# EAGLE design sidewinder (EAGLE 9.6.2)
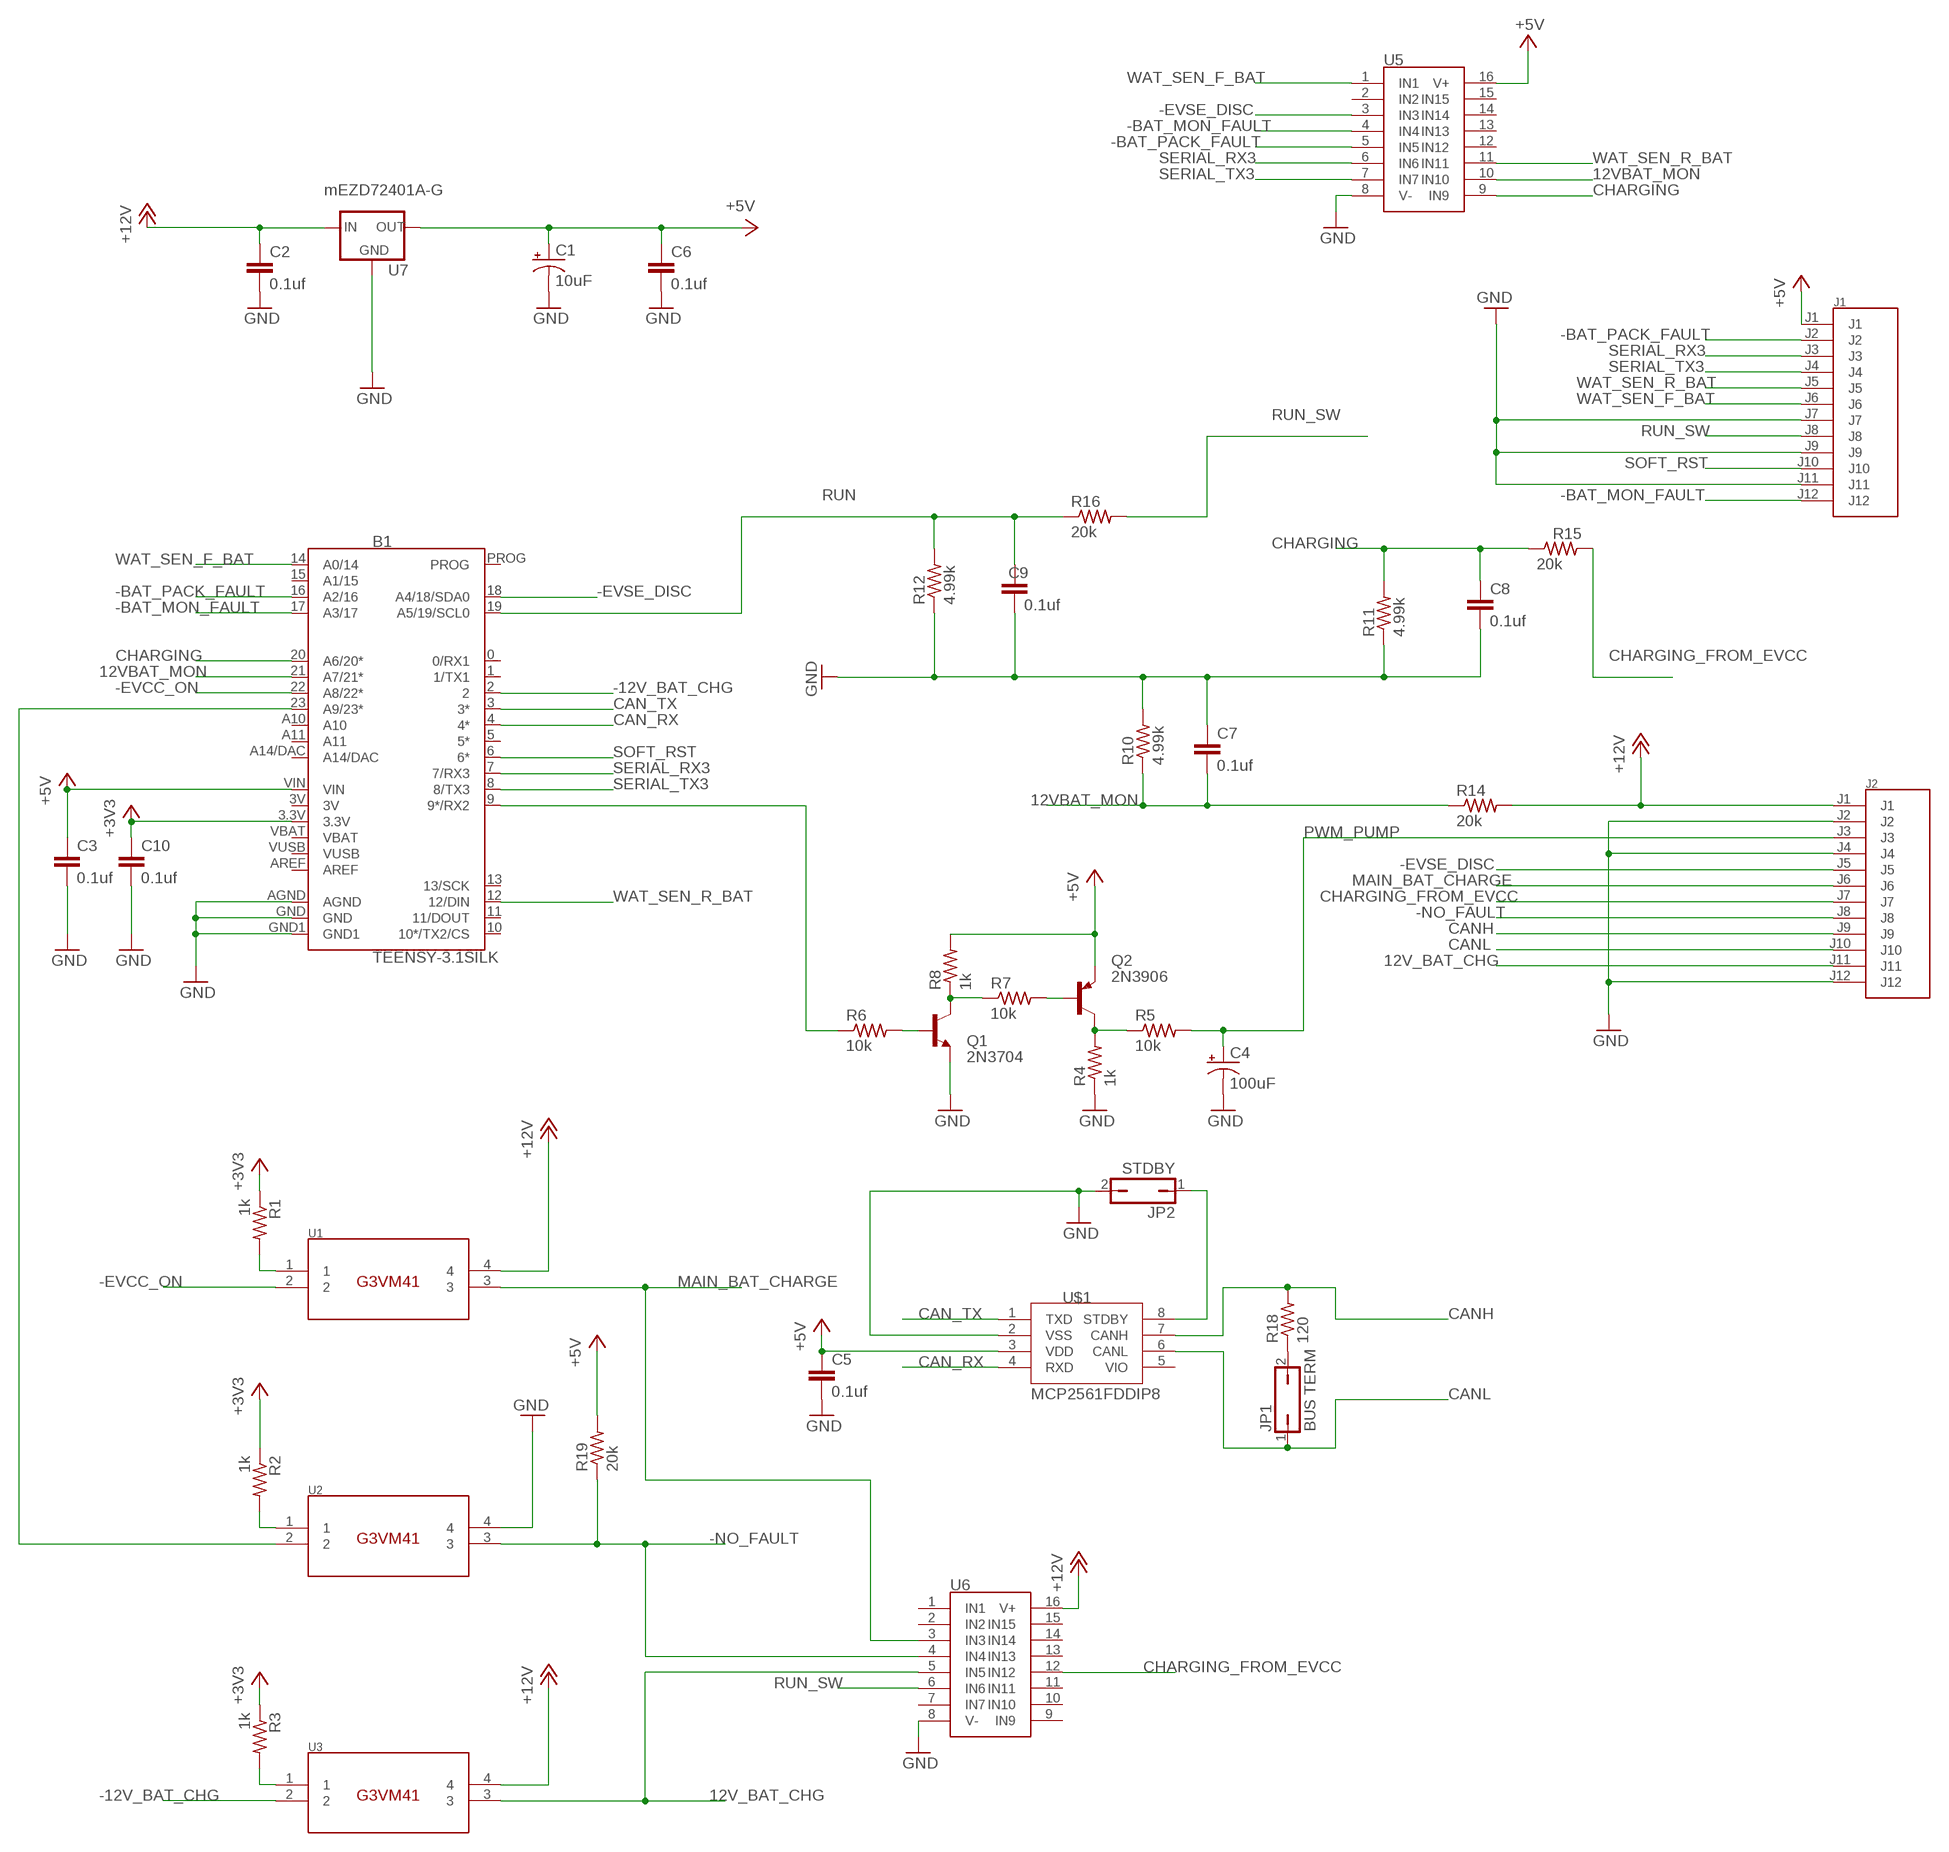
[diagram p0: schematic, sheet 1]

## Parts
B1  TEENSY-3.1SILK  [TEENSY-3.1]
C1  10uF  10UF-POLAR-RADIAL-2.5MM-25V-20%  [CPOL-RADIAL-2.5MM-5MM]
C2  0.1uf  C2.5/2  [C2.5-2]
C3  0.1uf  C2.5/2  [C2.5-2]
C4  100uF  100UF-POLAR-RADIAL-2.5MM-25V-20%  [CPOL-RADIAL-2.5MM-6.5MM]
C5  0.1uf  C2.5/2  [C2.5-2]
C6  0.1uf  C2.5/2  [C2.5-2]
C7  0.1uf  C2.5/2  [C2.5-2]
C8  0.1uf  C2.5/2  [C2.5-2]
C9  0.1uf  C2.5/2  [C2.5-2]
C10  0.1uf  C2.5/2  [C2.5-2]
J1  TERMINAL12  [TERMINAL12]
J2  TERMINAL12  [TERMINAL12]
JP1  BUS TERM  JP1Q  [JP1]
JP2  STDBY  JP1Q  [JP1]
Q1  2N3704  [TO92]
Q2  2N3906  [TO92]
R1  1k  R-US_0207/10  [0207/10]
R2  1k  R-US_0207/10  [0207/10]
R3  1k  R-US_0207/10  [0207/10]
R4  1k  R-US_0207/10  [0207/10]
R5  10k  R-US_0207/10  [0207/10]
R6  10k  R-US_0207/10  [0207/10]
R7  10k  R-US_0207/10  [0207/10]
R8  1k  R-US_0207/10  [0207/10]
R10  4.99k  R-US_0207/10  [0207/10]
R11  4.99k  R-US_0207/10  [0207/10]
R12  4.99k  R-US_0207/10  [0207/10]
R14  20k  R-US_0207/10  [0207/10]
R15  20k  R-US_0207/10  [0207/10]
R16  20k  R-US_0207/10  [0207/10]
R18  120  R-US_0207/10  [0207/10]
R19  20k  R-US_0207/10  [0207/10]
U1  G3VM41  [G3VM41]
U2  G3VM41  [G3VM41]
U3  G3VM41  [G3VM41]
U5  SP720APP  [DIP16]
U6  SP720APP  [DIP16]
U7  mEZD72401A-G  V_REG_78XXSINK  [TO220-IGO]
U$1  MCP2561FDDIP8  [DIP787W45P254L949H533Q8B]

## Nets
12V_BAT_CHG: J2.J11 U3.3 U6.5(IN5)
12VBAT_MON: B1.21(A7/21*) C7.2 R10.1 R14.1 U5.10(IN10)
+3V3 [VCC]: B1.3.3V C10.1 R1.1 R2.1 R3.1
+5V [VCC]: B1.VIN C1.1(+) C3.1 C5.1 C6.1 J1.J1 Q2.3(E) R8.2 R19.2 U5.16(V+) U7.OUT U$1.3(VDD)
+12V [VCC]: C2.1 J2.J1 R14.2 U1.4 U3.4 U6.16(V+) U7.IN
-12V_BAT_CHG: B1.2 U3.2
-BAT_MON_FAULT: B1.17(A3/17) J1.J12 U5.4(IN4)
-BAT_PACK_FAULT: B1.16(A2/16) J1.J2 U5.5(IN5)
-EVCC_ON: B1.22(A8/22*) U1.2
-EVSE_DISC: B1.18(A4/18/SDA0) J2.J5 U5.3(IN3)
-NO_FAULT: J2.J8 R19.1 U2.3 U6.4(IN4)
CAN_RX: B1.4(4*) U$1.4(RXD)
CAN_TX: B1.3(3*) U$1.1(TXD)
CANH: J2.J9 R18.2 U$1.7(CANH)
CANL: J2.J10 JP1.1 U$1.6(CANL)
CHARGING: B1.20(A6/20*) C8.1 R11.2 R15.1 U5.9(IN9)
CHARGING_FROM_EVCC: J2.J7 R15.2 U6.12(IN12)
GND: B1.AGND B1.GND B1.GND1 C1.2(-) C2.2 C3.2 C4.2(-) C5.2 C6.2 C7.1 C8.2 C9.2 C10.2 J1.J7 J1.J9 J1.J11 J2.J2 J2.J4 J2.J12 JP2.2 Q1.3(E) R4.1 R10.2 R11.1 R12.1 U2.4 U5.8(V-) U6.8(V-) U7.GND U$1.2(VSS)
MAIN_BAT_CHARGE: J2.J6 U1.3 U6.3(IN3)
N$1: B1.23(A9/23*) U2.2
N$3: B1.9(9*/RX2) R6.1
N$5: Q1.1(B) R6.2
N$6: Q1.2(C) R7.1 R8.1
N$7: Q2.2(B) R7.2
N$8: R1.2 U1.1
N$9: R2.2 U2.1
N$10: R3.2 U3.1
N$11: Q2.1(C) R4.2 R5.1
N$12: JP2.1 U$1.8(STDBY)
N$13: JP1.2 R18.1
PWM_PUMP: C4.1(+) J2.J3 R5.2
RUN: B1.19(A5/19/SCL0) C9.1 R12.2 R16.1
RUN_SW: J1.J8 R16.2 U6.6(IN6)
SERIAL_RX3: B1.7(7/RX3) J1.J3 U5.6(IN6)
SERIAL_TX3: B1.8(8/TX3) J1.J4 U5.7(IN7)
SOFT_RST: B1.6(6*) J1.J10
WAT_SEN_F_BAT: B1.14(A0/14) J1.J6 U5.1(IN1)
WAT_SEN_R_BAT: B1.12(12/DIN) J1.J5 U5.11(IN11)
Unconnected: B1.0(0/RX1) B1.1(1/TX1) B1.5(5*) B1.10(10*/TX2/CS) B1.11(11/DOUT) B1.13(13/SCK) B1.15(A1/15) B1.A10 B1.A11 B1.A14/DAC B1.AREF B1.PROG U5.2(IN2) U5.12(IN12) U5.13(IN13) U5.14(IN14) U5.15(IN15) U6.1(IN1) U6.2(IN2) U6.7(IN7) U6.9(IN9) U6.10(IN10) U6.11(IN11) U6.13(IN13) U6.14(IN14) U6.15(IN15) U$1.5(VIO)

## Power pins joined to a net without a drawn wire
3V: B1.3V
VBAT: B1.VBAT
VUSB: B1.VUSB

## Library data of the parts
B1 = SparkFun-Boards:TEENSY-3.1: Teensy 3+ Footprint Mechanical footprint with connectors for Teensy Development Board with ARM Cortex. SparkFun Products: Teensy 3.2 <https://www.sparkfun.com/products/13736> Teensy LC <https://www.sparkfun.com/products/13305>; SF_ID: DEV-12646
C1 = SparkFun-Capacitors:10UF-POLAR: 10.0µF polarized capacitors A capacitor is a passive two-terminal electrical component used to store electrical energy temporarily in an electric field.; PROD_ID: CAP-08440
C2 C3 C5-C10 = capacitor-wima:C: CAPACITOR naming: grid - package width
C4 = SparkFun-Capacitors:100UF-POLAR: 100µF polarized capacitors A capacitor is a passive two-terminal electrical component used to store electrical energy temporarily in an electric field.; PROD_ID: CAP-08439
J1 J2 = terminal12:TERMINAL12
JP1 JP2 = jumper:JP1Q: JUMPER
Q1 = transistor:2N3704: NPN TRANSISTOR
Q2 = transistor-pnp:2N3906: PNP Transistor
R1-R8 R10-R12 R14-R16 R18 R19 = rcl:R-US_: RESISTOR, American symbol; SPICEPREFIX: R
U1-U3 = G3VM41:G3VM41
U5 U6 = sp720app:SP720APP
U7 = SparkFun-IC-Power:V_REG_78XX: Voltage Regulator Standard 78xx regulator. IGO (Input Ground Output). Spark Fun Electronics SKU : COM-00107
U$1 = MCP2561FD:MCP2561FD

## Module BMS
Ports: +5V(io)

### Library data of the parts

## Net classes
0 default: width 0.305 mm, drill 0.508 mm, clearance 0.305 mm
1 VCC: width 0.508 mm, drill 0.508 mm, clearance 0.508 mm

## Board
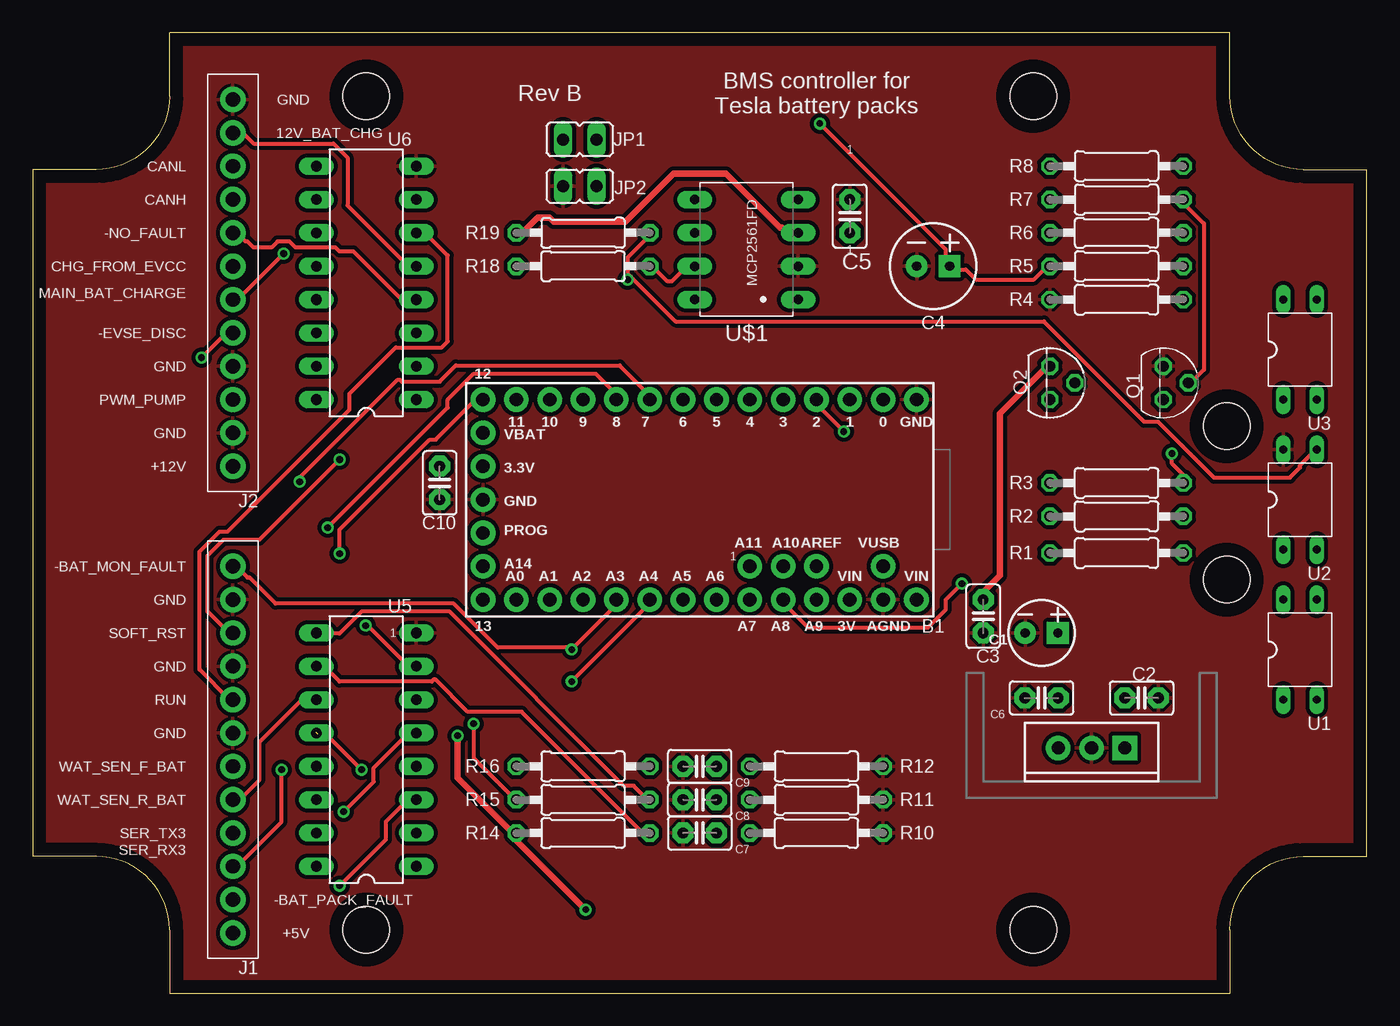
[diagram p1: board, top side]
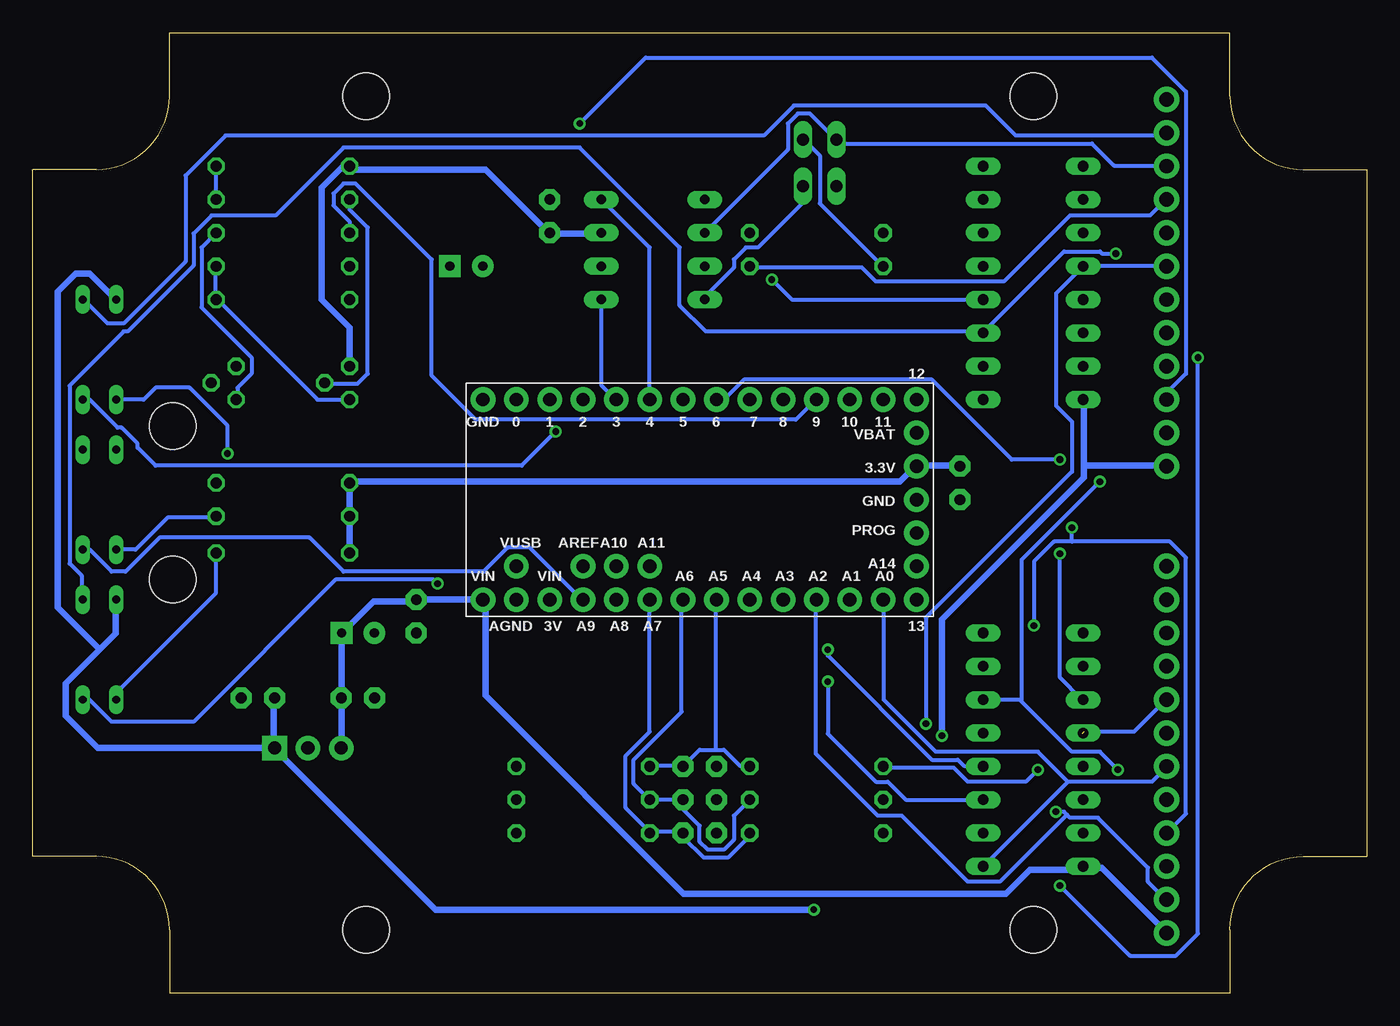
[diagram p2: board, bottom side, seen from below]

Size 101.6 x 73.15 mm. Coordinates in mm from the lower left corner, seen from the top.
Outline: 91.19,73.15 10.41,73.15 10.41,68.33 arc-90 4.83,62.74 0,62.74 0,10.41 4.83,10.41 arc-90 10.41,4.83 10.41,0 91.19,0 91.19,4.83 arc-90 96.77,10.41 101.6,10.41 101.6,62.74 96.77,62.74 arc-90 91.19,68.33 91.19,73.15
Copper layers (1*16): Top 0.035mm / dielectric 1.5mm / Bottom 0.035mm
Design rules "default": minimum track width 6mil, minimum drill 0.35mm, track to track 6mil, track to pad 6mil, pad to pad 6mil, via to via 6mil, smd to smd 6mil, copper to edge 40mil, drill to drill 6mil, minimum pad ring 10mil, minimum via ring 8mil, stop-mask expansion 4mil, vias tented up to drill 0mil, thermal gap 10mil
Holes 3.56 mm at 76.2,68.33 25.4,68.33 76.2,4.83 25.4,4.83 90.93,31.5 90.93,43.18

### Footprints (pad centres in the part's own frame; a part is rotated, then mirrored left to right if it is on the bottom)
TEENSY-3.1 = drill 1.016 pad 1.88: 0 7.62,-13.97; 1 7.62,-11.43; 2 7.62,-8.89; 3 7.62,-6.35; 3.3V 2.54,16.51; 3V -7.62,-11.43; 4 7.62,-3.81; 5 7.62,-1.27; 6 7.62,1.27; 7 7.62,3.81; 8 7.62,6.35; 9 7.62,8.89; 10 7.62,11.43; 11 7.62,13.97; 12 7.62,16.51; 13 -7.62,16.51; 14 -7.62,13.97; 15 -7.62,11.43; 16 -7.62,8.89; 17 -7.62,6.35; 18 -7.62,3.81; 19 -7.62,1.27; 20 -7.62,-1.27; 21 -7.62,-3.81; 22 -7.62,-6.35; 23 -7.62,-8.89; A10 -5.08,-6.35; A11 -5.08,-3.81; A14/DAC -5.08,16.51; AGND -7.62,-13.97; AREF -5.08,-8.89; GND 0,16.51; GND1 7.62,-16.51; PROG -2.54,16.51; VBAT 5.08,16.51; VIN -7.62,-16.51; VUSB -5.08,-13.97
CPOL-RADIAL-2.5MM-5MM = drill 0.7 pad 1.651 square: 1 1.25,0 | drill 0.7 pad 1.651: 2 -1.25,0
C2.5-2 = drill 0.813 pad 1.6 octagon: 1 -1.27,0; 2 1.27,0
CPOL-RADIAL-2.5MM-6.5MM = drill 0.7 pad 1.651 square: 1 1.25,0 | drill 0.7 pad 1.651: 2 -1.25,0
TERMINAL12 = drill 1.092 pad 1.93: J1 -2.54,16.51; J2 -2.54,13.97; J3 -2.54,11.43; J4 -2.54,8.89; J5 -2.54,6.35; J6 -2.54,3.81; J7 -2.54,1.27; J8 -2.54,-1.27; J9 -2.54,-3.81; J10 -2.54,-6.35; J11 -2.54,-8.89; J12 -2.54,-11.43
JP1 = drill 0.914 long: 1 0,-1.27; 2 0,1.27
TO92 = drill 0.813 octagon: 1 1.27,0; 2 0,1.905; 3 -1.27,0
0207/10 = drill 0.813 octagon: 1 -5.08,0; 2 5.08,0
G3VM41 = drill 0.6 long: 1 -3.81,1.27; 2 -3.81,-1.27; 3 3.81,-1.27; 4 3.81,1.27
DIP16 = drill 0.813 long: 1 -7.62,-3.81; 2 -5.08,-3.81; 3 -2.54,-3.81; 4 0,-3.81; 5 2.54,-3.81; 6 5.08,-3.81; 7 7.62,-3.81; 8 10.16,-3.81; 9 10.16,3.81; 10 7.62,3.81; 11 5.08,3.81; 12 2.54,3.81; 13 0,3.81; 14 -2.54,3.81; 15 -5.08,3.81; 16 -7.62,3.81
TO220-IGO = drill 1 pad 1.88: GND 0,0; OUT 2.54,0 | drill 1 pad 1.88 square: IN -2.54,0
DIP787W45P254L949H533Q8B = drill 0.723 pad 1.323 long: 1 -3.937,3.81; 2 -3.937,1.27; 3 -3.937,-1.27; 4 -3.937,-3.81; 5 3.937,-3.81; 6 3.937,-1.27; 7 3.937,1.27; 8 3.937,3.81

### Placement (x,y rotation side)
B1  50.8,37.59 90 top
C1  76.84,27.43 0 top
C2  84.45,22.48 0 top
C3  72.39,28.7 270 top
C4  68.58,55.37 0 top
C5  62.23,59.18 90 top
C6  76.84,22.48 180 top
C7  50.8,12.19 0 top
C8  50.8,14.73 180 top
C9  50.8,17.27 180 top
C10  30.99,38.86 270 top
J1  12.7,21.08 180 top
J2  12.7,56.64 180 top
JP1  41.66,65.02 270 top
JP2  41.66,61.47 90 top
Q1  86.11,46.48 270 top
Q2  77.47,46.48 270 top
R1  82.55,33.53 0 top
R2  82.55,36.32 0 top
R3  82.55,38.86 0 top
R4  82.55,52.83 0 top
R5  82.55,55.37 180 top
R6  82.55,57.91 0 top
R7  82.55,60.45 180 top
R8  82.55,62.99 180 top
R10  59.69,12.19 0 top
R11  59.69,14.73 180 top
R12  59.69,17.27 180 top
R14  41.91,12.19 180 top
R15  41.91,14.73 180 top
R16  41.91,17.27 180 top
R18  41.91,55.37 0 top
R19  41.91,57.91 180 top
U1  96.52,26.16 90 top
U2  96.52,37.59 90 top
U3  96.52,49.02 90 top
U5  25.4,17.27 90 top
U6  25.4,52.83 90 top
U7  80.64,18.67 180 top
U$1  54.36,56.64 180 top

### Tracks (layer width: path | path; a pad name or v marks a point on that pad's centre or on a via)
12V_BAT_CHG
  Top 0.305: U6.5 29.16,55.42 28.55,55.42 23.98,59.99 23.98,63.65 22.91,64.72 16.81,64.72 16.05,65.48 15.29,65.48 J2.J11
  Bottom 0.305: J2.J11 15.44,65.33 26.72,65.33 29.01,67.62 43.64,67.62 45.92,65.33 86.92,65.33 89.97,62.28 89.97,55.73 94.69,51 95.91,51 97.74,52.83 U3.3
12VBAT_MON
  Top 0.305: U5.10 21.69,24.79 22.3,24.79 23.37,23.72 30.38,23.72 30.53,23.88 30.68,23.88 33.12,21.44 37.24,21.44 46.38,12.29 46.99,12.29 R14.1
  Bottom 0.305: 54.61,12.29 52.17,12.29 C7.2 52.02,12.14 52.02,11.84 50.5,10.31 48.67,10.31 46.99,11.99 R14.1 | B1.21 54.61,19.91 56.44,18.09 56.44,14.12 54.61,12.29 | 54.61,12.29 R10.1
+3V3
  Bottom 0.508: R1.1 R2.1 R3.1 77.32,38.96 35.56,38.96 34.49,40.03 B1.3.3V 34.19,40.18 30.99,40.18 C10.1
+5V
  Top 0.508: R19.2 36.93,58.01 37.39,58.01 38.46,59.08 39.37,59.08 39.67,58.78 45.16,58.78 48.82,62.43 52.78,62.43 56.9,58.32 57.05,58.32 57.35,58.01 58.27,58.01 U$1.3 | Q2.3 77.47,47.65 77.17,47.65 73.66,44.14 73.66,31.8 72.44,30.58 72.44,29.97 C3.1
  Bottom 0.508: Q2.3 77.47,50.7 79.6,52.83 79.6,61.37 78.08,62.89 77.47,62.89 R8.2 77.32,62.74 67.11,62.74 62.38,58.01 C5.1 62.23,57.86 58.42,57.86 U$1.3 | J1.J1 15.29,4.67 20.17,9.55 21.54,9.55 U5.16 21.69,9.4 25.65,9.4 27.48,7.57 52.02,7.57 67.11,22.66 67.11,29.82 B1.VIN C3.1 72.59,29.82 75.64,29.82 77.93,27.53 C1.1 78.08,27.38 78.08,22.66 C6.1 78.08,22.35 78.08,18.69 U7.OUT
+12V  (via drill 0.51)
  Top 0.508: v32.36,19.61 32.36,16.41 36.47,12.29 36.78,12.29 R14.2 36.78,11.99 36.78,11.68 v42.11,6.35
  Bottom 0.508: 96.52,26.16 99.11,23.57 99.11,21.13 96.67,18.69 83.26,18.69 U7.IN | 96.52,26.16 95.3,27.38 95.3,29.97 U1.4 | 96.52,26.16 99.72,29.36 99.72,53.44 98.35,54.81 97.28,54.81 95.3,52.83 U3.4 | C2.1 83.26,22.35 83.26,18.85 U7.IN | v32.36,19.61 32.36,28.45 21.54,39.27 21.54,40.18 | 21.54,40.18 21.54,45.21 U6.16 | 21.54,40.18 15.29,40.18 J2.J1 | v42.11,6.35 70.92,6.35 83.11,18.54 U7.IN
-12V_BAT_CHG  (via drill 0.51)
  Top 0.305: v61.77,42.77 59.79,44.75 59.79,45.21 B1.2
  Bottom 0.305: U3.2 97.28,45.21 95.15,43.08 94.84,43.08 93.62,41.86 93.62,41.55 92.25,40.18 64.36,40.18 v61.77,42.77
-BAT_MON_FAULT  (via drill 0.51)
  Top 0.305: B1.17 44.4,29.97 44.4,29.52 v41.05,26.16 41.05,26.31 35.41,26.31 32.05,29.67 18.49,29.67 16.51,31.65 16.36,31.65 15.6,32.41 15.29,32.41 J1.J12
  Bottom 0.305: v41.05,26.16 41.05,25.7 33.12,17.78 31.14,17.78 30.68,17.32 29.31,17.32 U5.4
-BAT_PACK_FAULT  (via drill 0.51)
  Top 0.305: v23.67,13.82 25.96,16.1 25.96,17.17 28.55,19.76 29.16,19.76 U5.5
  Bottom 0.305: v23.67,13.82 23.06,13.82 22.84,13.59 | 22.84,13.59 22.61,13.36 20.47,13.36 16.66,9.55 16.66,8.48 15.29,7.11 J1.J2 | 22.84,13.59 27.94,8.48 30.38,8.48 35.41,13.51 37.24,13.51 41.96,18.24 41.96,29.97 B1.16
-EVCC_ON  (via drill 0.51)
  Top 0.305: v70.76,31.19 69.55,29.97 69.55,29.21 68.17,27.84 59.03,27.84 57.2,29.67 57.2,29.97 B1.22
  Bottom 0.305: U1.2 97.28,22.35 95.61,20.68 89.36,20.68 78.54,31.5 71.07,31.5 v70.76,31.19
-EVSE_DISC  (via drill 0.51)
  Top 0.305: v41.05,23.72 46.99,29.67 B1.18 | v12.85,48.41 14.68,50.24 15.14,50.24 J2.J5 | v23.37,8.18 26.87,11.68 26.87,13.06 28.55,14.73 U5.3
  Bottom 0.305: U5.3 35.1,14.73 36.47,16.1 37.39,16.1 41.05,19.76 v41.05,23.72 | v12.85,48.41 12.85,4.52 14.53,2.84 18.03,2.84 v23.37,8.18
-NO_FAULT  (via drill 0.51)
  Top 0.305: 45.54,54.59 45.31,54.81 45.31,56.03 46.99,57.71 R19.1 | 45.54,54.59 48.97,51.16 77.01,51.16 84.63,43.54 85.7,43.54 89.97,39.27 95.76,39.27 96.52,40.03 96.52,40.18 97.74,41.4 U2.3 | 45.54,54.59 v45.31,54.36 | U6.4 28.09,52.83 24.43,56.49 23.37,56.49 23.06,56.79 20.02,56.79 19.56,57.25 18.64,57.25 18.19,56.79 16.81,56.79 16.36,57.25 16.2,57.25 15.6,57.86 15.29,57.86 J2.J8
  Bottom 0.305: U6.4 43.79,52.83 v45.31,54.36
CAN_RX
  Bottom 0.305: B1.4 54.61,56.79 58.27,60.45 U$1.4
CAN_TX
  Bottom 0.305: U$1.1 58.27,52.83 58.27,46.28 57.2,45.21 B1.3
CANH
  Top 0.305: R18.2 46.99,55.27 47.3,55.27 48.36,54.2 48.67,54.2 49.73,55.27 50.34,55.27 U$1.7
  Bottom 0.305: R18.2 46.99,55.27 38.46,55.27 37.39,54.2 27.63,54.2 22.61,59.23 16.51,59.23 15.29,60.45 J2.J9
CANL
  Bottom 0.305: U$1.6 50.34,58.01 44.09,64.26 44.09,66.24 43.33,67.01 42.42,67.01 40.44,65.02 JP1.1 40.28,65.02 39.98,64.72 20.93,64.72 19.25,63.04 15.29,63.04 J2.J10
CHARGING
  Top 0.305: R15.1 46.84,14.73 45.77,15.8 45.01,15.8 31.75,29.06 25.04,29.06 23.37,27.38 21.69,27.38 U5.9
  Bottom 0.305: B1.20 52.17,29.97 52.17,21.44 55.83,17.78 55.83,15.95 R11.2 C8.1 52.02,14.73 52.02,13.97 50.8,12.75 50.8,11.53 50.19,10.92 48.97,10.92 48.21,11.68 48.21,13.51 R15.1
CHARGING_FROM_EVCC  (via drill 0.51)
  Top 0.305: v33.58,20.52 33.58,17.93 36.78,14.73 R15.2
  Bottom 0.305: v33.58,20.52 33.58,28.6 22.45,39.73 22.45,43.54 23.67,44.75 23.67,53.29 U6.12 21.54,55.42 15.29,55.42 J2.J7
GND
  pour Top: -0.76,76.71 103.12,76.71 103.12,-2.29 -4.57,-2.29 -4.57,76.2 -4.32,76.45
MAIN_BAT_CHARGE  (via drill 0.51)
  Top 0.305: J2.J6 15.6,52.83 v19.1,56.34
  Bottom 0.305: U1.3 97.89,29.97 97.89,31.8 98.81,32.72 98.81,46.28 94.69,50.39 94.39,50.39 89.36,55.42 89.36,57.86 87.99,59.23 83.11,59.23 77.93,64.41 59.94,64.41 52.32,56.79 52.32,52.38 50.34,50.39 29.31,50.39 U6.3 29.16,50.39 23.06,56.49 20.32,56.49 20.17,56.34 v19.1,56.34
N$1
  Bottom 0.305: U2.2 97.28,33.78 95.61,32.11 94.54,32.11 91.95,34.7 80.52,34.7 77.93,32.11 67.26,32.11 65.43,33.93 63.75,33.93 59.79,29.97 B1.23
N$3
  Bottom 0.305: R6.1 77.47,58.78 78.69,59.99 78.69,60.91 77.93,61.67 77.01,61.67 71.22,55.88 71.22,47.04 67.87,43.69 43.48,43.69 41.96,45.21 B1.9
N$5
  Bottom 0.305: R6.2 88.75,56.79 88.75,52.22 84.94,48.41 84.94,47.19 86,46.13 86,45.21 Q1.1
N$6
  Top 0.305: Q1.2 88.14,46.58 88.29,46.58 89.2,47.5 89.2,58.62 87.68,60.15 87.68,60.45 R7.1
  Bottom 0.305: R7.1 87.68,60.45 87.68,62.89 R8.1
N$7
  Bottom 0.305: R7.2 77.47,59.69 76.1,58.32 76.1,47.19 76.86,46.43 79.3,46.43 Q2.2
N$8
  Bottom 0.305: U1.1 95.15,22.35 95.15,22.96 87.68,30.43 87.68,33.48 R1.2
N$9
  Bottom 0.305: U2.1 93.78,33.78 91.34,36.22 87.68,36.22 R2.2
N$10  (via drill 0.51)
  Top 0.305: v86.77,41.1 86.77,40.34 87.68,39.42 87.68,38.96 R3.2
  Bottom 0.305: U3.1 93.17,45.21 92.25,46.13 89.66,46.13 86.77,43.23 v86.77,41.1
N$11
  Bottom 0.305: Q2.1 79.91,45.21 87.53,52.83 R4.2 87.68,52.83 87.68,55.27 R5.1
N$12
  Bottom 0.305: U$1.8 50.34,52.83 50.34,53.14 48.21,55.27 48.21,55.88 47.3,56.79 46.38,56.79 43.03,60.15 43.03,61.37 JP2.1
N$13
  Bottom 0.305: R18.1 36.93,55.42 41.66,60.15 41.66,63.8 42.88,65.02 JP1.2
PWM_PUMP  (via drill 0.51)
  Top 0.305: R5.2 77.47,55.27 77.17,55.27 76.25,54.36 71.83,54.36 71.07,55.12 70,55.12 69.85,55.27 C4.1 69.7,55.42 69.55,55.57 69.55,56.64 v59.94,66.24
  Bottom 0.305: v59.94,66.24 54.91,71.27 16.36,71.27 13.77,68.68 13.77,47.19 15.14,45.82 15.14,45.21 J2.J3
RUN
  Bottom 0.305: 49.58,18.54 50.8,18.54 C9.1 52.17,17.32 54.61,17.32 R12.2 | 49.58,18.54 48.97,18.54 47.75,17.32 46.99,17.32 R16.1 | 49.58,18.54 49.58,29.97 B1.19
RUN_SW  (via drill 0.51)  (1 unrouted)
  Top 0.305: v25.04,17.02 22.3,19.76 21.69,19.76 | J1.J8 14.99,22.35 12.7,24.64 12.7,33.63 14.22,35.15 14.83,35.15 24.13,44.45 24.13,45.67 27.63,49.17 31.14,49.17 31.6,49.63 31.6,56.18 29.92,57.86 29.31,57.86 U6.6
  Bottom 0.305: 21.54,19.91 17.73,19.91 15.29,22.35 J1.J8 | v25.04,17.02 25.96,16.1 30.38,16.1 31.45,17.17 36.78,17.17 R16.2
SERIAL_RX3  (via drill 0.51)
  Top 0.305: v18.95,17.02 18.95,13.06 15.6,9.7 15.29,9.7 J1.J3 | B1.7 46.99,45.52 44.7,47.8 32.21,47.8 30.99,46.58 28.09,46.58 27.94,46.74 27.79,46.74 20.32,39.27 v20.32,38.96
  Bottom 0.305: U5.6 26.42,22.35 26.34,22.28 | 26.34,22.28 22.45,18.39 20.32,18.39 v18.95,17.02 | v20.32,38.96 26.26,33.02 26.26,22.35 26.34,22.28
SERIAL_TX3  (via drill 0.51)
  Top 0.305: v25.35,27.99 25.5,27.99 28.55,24.94 29.16,24.94 U5.7 | v22.45,35.46 31.6,44.6 31.6,45.21 33.58,47.19 42.88,47.19 44.4,45.67 44.4,45.21 B1.8
  Bottom 0.305: v25.35,27.99 25.35,32.87 23.82,34.39 22.45,34.39 | 22.45,34.39 14.99,34.39 13.77,33.17 13.77,13.66 J1.J4 | 22.45,34.39 v22.45,35.46
SOFT_RST  (via drill 0.51)
  Top 0.305: v23.37,40.64 17.27,34.54 14.53,34.54 13.31,33.32 13.31,29.06 14.83,27.53 15.14,27.53 J1.J10
  Bottom 0.305: B1.6 48.97,45.21 47.45,46.74 33.12,46.74 27.03,40.64 v23.37,40.64
WAT_SEN_F_BAT
  Bottom 0.305: 22.76,16.1 U5.1 | 22.76,16.1 16.36,16.1 15.29,17.17 J1.J6 | 22.76,16.1 25.04,18.39 32.82,18.39 36.78,22.35 36.78,29.97 B1.14
WAT_SEN_R_BAT  (via drill 0.51)
  Top 0.305: U5.11 20.47,22.35 17.27,19.15 17.27,16.26 15.75,14.73 J1.J5 | B1.12 33.73,45.21 30.68,42.16 30.23,42.16 23.37,35.31 v23.37,33.48
  Bottom 0.305: v23.37,33.48 23.37,24.03 21.69,22.35 U5.11

### Text on the board
tPlace: Rev B | BMS controller for / Tesla battery packs | GND | 12V_BAT_CHG | 1 | CANL | CANH | -NO_FAULT | 1 | CHG_FROM_EVCC | MAIN_BAT_CHARGE | -EVSE_DISC | GND | PWM_PUMP | GND | +12V | 1 | -BAT_MON_FAULT | GND | SOFT_RST | 1 | GND | RUN | GND | WAT_SEN_F_BAT | WAT_SEN_R_BAT | SER_TX3 | SER_RX3 | -BAT_PACK_FAULT | +5V